# Altium schematic sheet MARK1_AUDIO_PMOD.SchDoc
size B
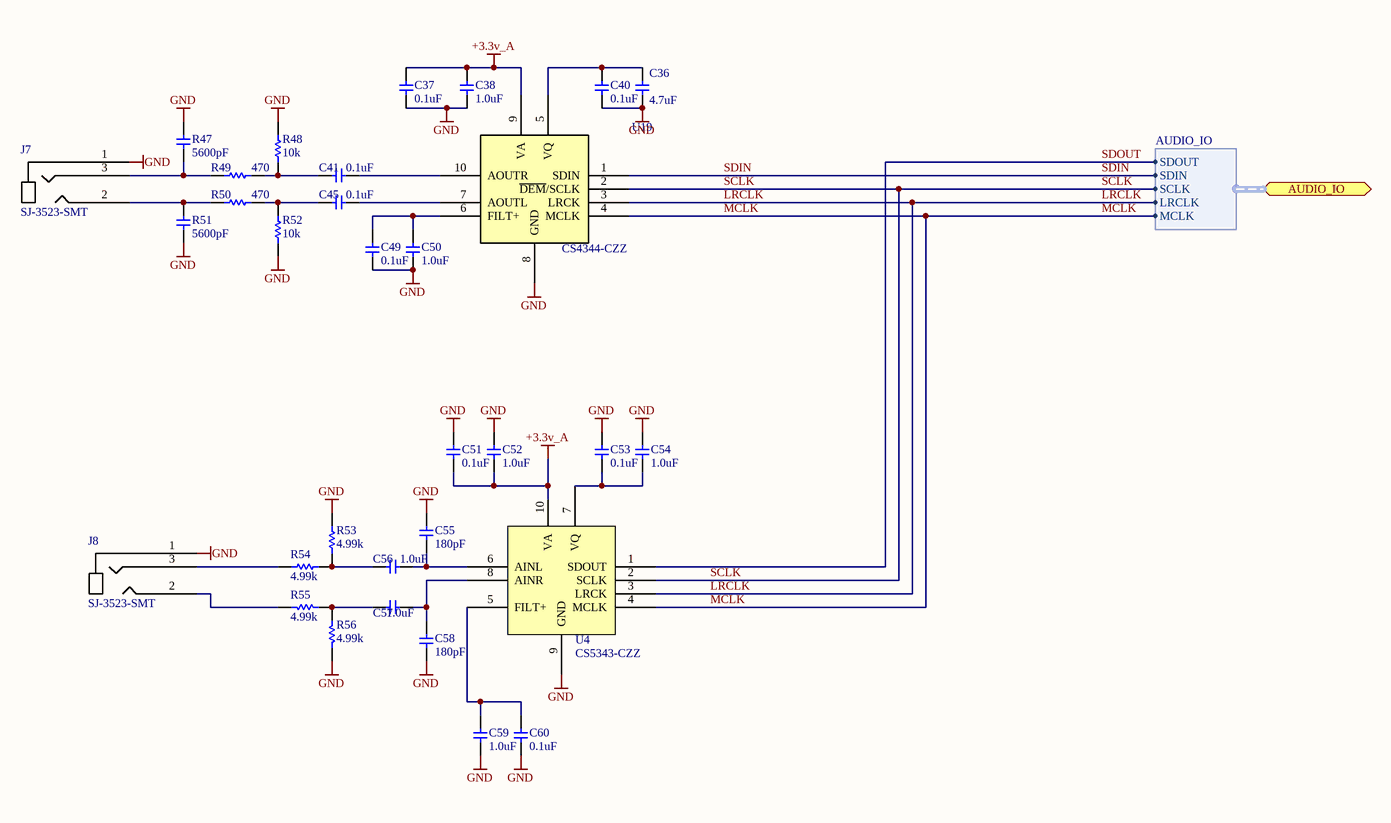
[diagram p0: MARK1_AUDIO_PMOD.SchDoc]

## Parts
C36  4.7uF  [C0603]
C37  0.1uF  [C0603]
C38  1.0uF  [C0805]
C40  0.1uF  [C0603]
C41  0.1uF  [C0603]
C45  0.1uF  [C0603]
C49  0.1uF  [C0603]
C50  1.0uF  [C0805]
C51  0.1uF  [C0603]
C52  1.0uF  [C0805]
C53  0.1uF  [C0603]
C54  1.0uF  [C0805]
C55  180pF  [C0603]
C56  1.0uF  [C0805]
C57  1.0uF  [C0805]
C58  180pF  [C0603]
C59  1.0uF  [C0805]
C60  0.1uF  [C0603]
J7  SJ-3523-SMT  [SJ-3523-SMT]
J8  SJ-3523-SMT  [SJ-3523-SMT]
R47  5600pF  [C0603]
R48  10k  [R0603]
R49  470  [R0603]
R50  470  [R0603]
R51  5600pF  [C0603]
R52  10k  [R0603]
R53  4.99k  [R0603]
R54  4.99k  [R0603]
R55  4.99k  [R0603]
R56  4.99k  [R0603]
U4  CS5343-CZZ  [TSSOP10]
U19  CS4344-CZZ  [TSSOP10]

## Ports
AUDIO_IO (harness AUDIO_IO)

## Harnesses
AUDIO_IO: SDOUT, SDIN, SCLK, LRCLK, MCLK

## Nets
+3.3v_A: C37.2 C38.2 C51.1 C52.1 U4.10(VA) U19.9(VA)
GND: C36.1 C37.1 C38.1 C40.1 C49.1 C50.1 C51.2 C52.2 C53.2 C54.2 C55.2 C58.1 C59.2 C60.2 J7.1 J8.1 R47.2 R48.1 R51.1 R52.2 R53.2 R56.2 U4.9(GND) U19.8(GND)
LRCLK: U4.3(LRCK) U19.3(LRCK) ; port AUDIO_IO.LRCLK
MCLK: U4.4(MCLK) U19.4(MCLK) ; port AUDIO_IO.MCLK
SCLK: U4.2(SCLK) U19.2(~{DEM}/SCLK) ; port AUDIO_IO.SCLK
SDIN: U19.1(SDIN) ; port AUDIO_IO.SDIN
SDOUT: U4.1(SDOUT) ; port AUDIO_IO.SDOUT
NetC36_2: C36.2 C40.2 U19.5(VQ)
NetC41_1: C41.1 U19.10(AOUTR)
NetC41_2: C41.2 R48.2 R49.1
NetC45_1: C45.1 U19.7(AOUTL)
NetC45_2: C45.2 R50.1 R52.1
NetC49_2: C49.2 C50.2 U19.6(FILT+)
NetC53_1: C53.1 C54.1 U4.7(VQ)
NetC55_1: C55.1 C56.2 U4.6(AINL)
NetC56_1: C56.1 R53.1 R54.2
NetC57_1: C57.1 R55.2 R56.1
NetC57_2: C57.2 C58.2 U4.8(AINR)
NetC59_1: C59.1 C60.1 U4.5(FILT+)
NetJ7_2: J7.2 R50.2 R51.2
NetJ7_3: J7.3 R47.1 R49.2
NetJ8_2: J8.2 R55.1
NetJ8_3: J8.3 R54.1

## Notes on the sheet
- 2
- Wavenumber
- pl
- -1
- Rev:
- Technologies
- Sheet
- of

## Library data of the parts
C36 = GRM188R60J475KE19D: CAP CER 4.7UF 6.3V X5R 0603; Manufacturer: Murata Electronics North America; Capacitance: 4.7µF; Tolerance: ±10%; Supplier 1: Digi-Key; Supplier Part Number 1: 490-3297-1-ND; Manufacturer Part Number: GRM188R60J475KE19D; RoHS: RoHS Compliant; Category: Capacitors; Stock 1: 714091; Pricing 1: 10=0.214, 50=0.148, 100=0.1142, 250=0.08204, 500=0.0585, 1000=0.04281 (USD); Voltage - Rated: 6.3V; Temperature Coefficient: X5R; Mounting Type: Surface Mount, MLCC; Operating Temperature: -55°C ~ 85°C; Applications: General Purpose; Ratings: -; Package / Case: 0603 (1608 Metric); Size / Dimension: 0.063" L x 0.031" W (1.60mm x 0.80mm); Height: -; Thickness: 0.035" (0.90mm); Lead Spacing: -; Features: -; Packaging: Cut Tape (CT); Lead Style: -; ComponentLink1URL: http://search.murata.co.jp/Ceramy/image/img/PDF/ENG/GRM188R60J475KE19.pdf; ComponentLink1Description: http://search.murata.co.jp/Ceramy/image/img/PDF/ENG/GRM188R60J475KE19.pdf; Value: 4.7uF
C37 C40 C41 C45 C49 C51 C53 C60 = GRM188R71H104KA93D: CAP CER .1UF 50V 10% X7R 0603; Manufacturer: Murata Electronics North America; Capacitance: 0.1µF; Manufacturer Part Number: GRM188R71H104KA93D; Value: CAP CER .1UF 50V 10% X7R 0603; Supplier 1: Digi-Key; Supplier Part Number 1: 490-1519-1-ND; RoHS: RoHS Compliant; Category: Capacitors; Stock 1: 9370695; Pricing 1: 10=0.037, 100=0.0221, 500=0.01276, 1000=0.00884 (USD); Voltage - Rated: 50V; Tolerance: ±10%; Temperature Coefficient: X7R; Mounting Type: Surface Mount, MLCC; Operating Temperature: -55°C ~ 125°C; Features: -; Applications: General Purpose; Ratings: -; Package / Case: 0603 (1608 Metric); Size / Dimension: 0.063" L x 0.031" W (1.60mm x 0.80mm); Lead Spacing: -; Thickness: 0.80mm; Packaging: Cut Tape (CT); Lead Style: -; ComponentLink1URL: http://search.murata.co.jp/Ceramy/image/img/PDF/ENG/GRM188R71H104KA93.pdf; ComponentLink1Description: http://search.murata.co.jp/Ceramy/image/img/PDF/ENG/GRM188R71H104KA93.pdf
C38 C50 C52 C54 C56 C57 C59 = GRM21BR71C105KA01L: CAP CER 1.0UF 16V 10% X7R 0805; Manufacturer: Murata Electronics North America; Capacitance: 1.0µF; Manufacturer Part Number: GRM21BR71C105KA01L; Value: CAP CER 1.0UF 16V 10% X7R 0805; Supplier 1: Digi-Key; Supplier Part Number 1: 490-1691-1-ND; RoHS: RoHS Compliant; Category: Capacitors; Stock 1: 1110851; Pricing 1: 10=0.106, 100=0.0624, 500=0.036, 1000=0.02496 (USD); Voltage - Rated: 16V; Tolerance: ±10%; Temperature Coefficient: X7R; Mounting Type: Surface Mount, MLCC; Operating Temperature: -55°C ~ 125°C; Features: -; Applications: General Purpose; Ratings: -; Package / Case: 0805 (2012 Metric); Size / Dimension: 0.079" L x 0.049" W (2.00mm x 1.25mm); Lead Spacing: -; Thickness: 1.25mm; Packaging: Cut Tape (CT); Lead Style: -; ComponentLink1URL: http://search.murata.co.jp/Ceramy/image/img/PDF/ENG/GRM21BR71C105KA01.pdf; ComponentLink1Description: http://search.murata.co.jp/Ceramy/image/img/PDF/ENG/GRM21BR71C105KA01.pdf
C55 C58 = C1608C0G1H181J: CAP CER 180PF 50V 5% NP0 0603; Manufacturer: TDK Corporation; Temperature Coefficient: C0G, NP0; Supplier 1: Digi-Key; Supplier Part Number 1: 445-1284-2-ND; Manufacturer Part Number: C1608C0G1H181J; RoHS: RoHS Compliant; Category: Capacitors; Stock 1: 192000; Pricing 1: 4000=0.01012, 8000=0.00924, 12000=0.0088, 28000=0.00836 (USD); Capacitance: 180pF; Voltage - Rated: 50V; Tolerance: ±5%; Mounting Type: Surface Mount, MLCC; Operating Temperature: -55°C ~ 125°C; Applications: General Purpose; Ratings: -; Package / Case: 0603 (1608 Metric); Size / Dimension: 0.063" L x 0.031" W (1.60mm x 0.80mm); Height - Seated (Max): -; Thickness (Max): 0.037" (0.95mm); Lead Spacing: -; Features: -; Packaging: Tape & Reel (TR); Lead Style: -; ComponentLink1URL: http://www.tdk.com/pdf/general_B11.pdf; ComponentLink1Description: http://www.tdk.com/pdf/general_B11.pdf; Value: 180pF
J7 J8 = SJ-3523-SMT: CONN AUDIO JACK 3.5MM STEREO SMD; Manufacturer: CUI Inc; Source Part Number: CP-3523SJCT-ND; Connector Type: Phone Jack; Gender: Female; Plug/Mating Plug Diameter: 3.50mm (0.141", 1/8", Mini Plug) - Headphone; Number of Positions/Contacts: 3 Conductors, 3 Contacts; Internal Switch(s): Does Not Contain Switch; Shielding: Unshielded; Color - Contact: Black; Voltage - Rated: 12VDC; Current Rating: 1A; Manufacturer Part Number: SJ-3523-SMT; Source: Digikey; ROHS Certificate: ROHS-CUI.pdf; Supplier 1: Digi-Key; Supplier Part Number 1: CP-3523SJCT-ND; RoHS: RoHS Compliant; Category: Connectors, Interconnects; Stock 1: 68095; Pricing 1: 1=1.34, 10=1.043, 100=0.7961, 500=0.63558 (USD); Signal Lines: Stereo; Mounting Type: Surface Mount, Right Angle; Termination: Solder; Features: -; Contact Material: Copper Alloy; Contact Material - Plating: Silver; Housing Material: Plastic; Housing Color: Black; Operating Temperature: -25°C ~ 85°C; Packaging: Cut Tape (CT); ComponentLink1URL: http://products.cui.com/GetSpecForDigiKey.aspx?MFGNum=SJ-3523-SMT; ComponentLink1Description: http://products.cui.com/GetSpecForDigiKey.aspx?MFGNum=SJ-3523-SMT; Value: SJ-3523-SMT
R47 R51 = GRM188R71H562KA01D: CAP CER 5600PF 50V 10% X7R 0603; Manufacturer: Murata Electronics North America; Value: CAP CER 5600PF 50V 10% X7R 0603; Supplier 1: Digi-Key; Manufacturer Part Number: GRM188R71H562KA01D; RoHS: RoHS Compliant; Category: Capacitors; Stock 1: 39960; Pricing 1: 10=0.059, 100=0.0351, 500=0.02026, 1000=0.01404 (USD); Capacitance: 5600pF; Voltage - Rated: 50V; Tolerance: ±10%; Temperature Coefficient: X7R; Mounting Type: Surface Mount, MLCC; Operating Temperature: -55°C ~ 125°C; Applications: General Purpose; Ratings: -; Package / Case: 0603 (1608 Metric); Size / Dimension: 0.063" L x 0.031" W (1.60mm x 0.80mm); Thickness: 0.80mm; Lead Spacing: -; Features: -; Packaging: Cut Tape (CT); Lead Style: -; ComponentLink1URL: http://search.murata.co.jp/Ceramy/image/img/PDF/ENG/GRM188R71H562KA01.pdf; ComponentLink1Description: http://search.murata.co.jp/Ceramy/image/img/PDF/ENG/GRM188R71H562KA01.pdf; Supplier Part Number 1: 490-1507-1-ND
R48 R52 = ERJ-3EKF1002V: RES 10.0K OHM 1/10W 1% 0603 SMD; Source Part Number: P10.0KHCT-ND; Manufacturer: Panasonic - ECG; Power (Watts): 0.1W, 1/10W; Temperature Coefficient: ±100ppm/°C; Source: Digikey; ROHS Certificate: *; RoHS: RoHS Compliant; Category: Resistors; Resistance In Ohms: 10.0K; Composition: Thick Film; Features: -; Tolerance: ±1%; Case: 0603 (1608 metric); Size / Dimension: 0.063" L x 0.031" W (1.60mm x 0.80mm); Height: 0.018" (0.45mm); Lead Style: Surface Mount (SMD - SMT); Packaging: Cut Tape (CT); ComponentLink1URL: http://industrial.panasonic.com/www-cgi/jvcr13pz.cgi?E+PZ+3+AOA0002+ERJ3EKF1002V+7+WW; ComponentLink1Description: http://industrial.panasonic.com/www-cgi/jvcr13pz.cgi?E+PZ+3+AOA0002+ERJ3EKF1002V+7+WW; Manufacturer Part Number: ERJ-3EKF1002V; Supplier 1: Digi-Key; Stock 1: 10570746; Pricing 1: 1=0.04, 50=0.015, 100=0.0114, 250=0.00844, 500=0.00624, 1000=0.00416 (USD); Supplier Part Number 1: P10.0KHCT-ND; Value: 10k
R49 R50 = ERJ-3EKF4700V: RES 470 OHM 1/10W 1% 0603 SMD; Manufacturer: Panasonic - ECG; Power (Watts): 0.1W, 1/10W; Temperature Coefficient: ±100ppm/°C; Manufacturer Part Number: ERJ-3EKF4700V; Value: RES 470 OHM 1/10W 1% 0603 SMD; Supplier 1: Digi-Key; Supplier Part Number 1: P470HCT-ND; RoHS: RoHS Compliant; Category: Resistors; Stock 1: 1087324; Pricing 1: 1=0.04, 50=0.015, 100=0.0114, 250=0.00844, 500=0.00624, 1000=0.00416 (USD); Resistance (Ohms): 470; Composition: Thick Film; Features: -; Tolerance: ±1%; Size / Dimension: 0.063" L x 0.031" W (1.60mm x 0.80mm); Height: 0.018" (0.45mm); Lead Style: Surface Mount (SMD - SMT); Packaging: Cut Tape (CT); Package / Case: 0603 (1608 Metric); ComponentLink1URL: http://industrial.panasonic.com/www-cgi/jvcr13pz.cgi?E+PZ+3+AOA0002+ERJ3EKF4700V+7+WW; ComponentLink1Description: http://industrial.panasonic.com/www-cgi/jvcr13pz.cgi?E+PZ+3+AOA0002+ERJ3EKF4700V+7+WW
R53-R56 = ERJ-3EKF4991V: RES 4.99K OHM 1/10W 1% 0603 SMD; Manufacturer: Panasonic - ECG; Power (Watts): 0.1W, 1/10W; Temperature Coefficient: ±100ppm/°C; Manufacturer Part Number: ERJ-3EKF4991V; Value: RES 4.99K OHM 1/10W 1% 0603 SMD; Supplier 1: Digi-Key; Supplier Part Number 1: P4.99KHCT-ND; RoHS: RoHS Compliant; Category: Resistors; Stock 1: 778327; Pricing 1: 1=0.04, 50=0.015, 100=0.0114, 250=0.00844, 500=0.00624, 1000=0.00416 (USD); Resistance (Ohms): 4.99K; Composition: Thick Film; Features: -; Tolerance: ±1%; Size / Dimension: 0.063" L x 0.031" W (1.60mm x 0.80mm); Height: 0.018" (0.45mm); Lead Style: Surface Mount (SMD - SMT); Packaging: Cut Tape (CT); Package / Case: 0603 (1608 Metric); ComponentLink1URL: http://industrial.panasonic.com/www-cgi/jvcr13pz.cgi?E+PZ+3+AOA0002+ERJ3EKF4991V+7+WW; ComponentLink1Description: http://industrial.panasonic.com/www-cgi/jvcr13pz.cgi?E+PZ+3+AOA0002+ERJ3EKF4991V+7+WW
U4 = CS5343-CZZ: IC ADC AUD 98DB 108KHZ 10-TSSOP; Manufacturer: rus Logic Inc; Source Part Number: 598-1189-ND; Manufacturer Part Number: CS5343-CZZ; Source: Digikey; Value: CS5343-CZZ
U19 = CS4344-CZZ: IC DAC STER 24BIT 192KHZ 10TSSOP; Manufacturer: rus Logic Inc; Source Part Number: 598-1051-5-ND; Number of Bits: 24; Data Interface: Serial; Number of Converters: 2; Voltage Supply Source: Single Supply; Power Dissipation (Max): 150mW; Manufacturer Part Number: CS4344-CZZ; Source: Digikey; Value: CS4344-CZZ; Supplier 1: Digi-Key; Supplier Part Number 1: 598-1051-5-ND; RoHS: RoHS Compliant; Category: Integrated Circuits (ICs); Stock 1: 1830; Pricing 1: 1=3.02, 25=2.43, 100=2.214, 250=1.998, 500=1.7928, 1000=1.512, 2500=1.4364, 5000=1.377, 10000=1.3392 (USD); Settling Time: -; Operating Temperature: -10°C ~ 70°C; Mounting Type: Surface Mount; Package / Case: 10-TFSOP (0.118", 3.00mm Width); Supplier Device Package: 10-TSSOP; Packaging: Tube; ComponentLink1URL: http://www.cirrus.com/en/pubs/proDatasheet/CS4344-45-46-48_F1.pdf; ComponentLink1Description: http://www.cirrus.com/en/pubs/proDatasheet/CS4344-45-46-48_F1.pdf